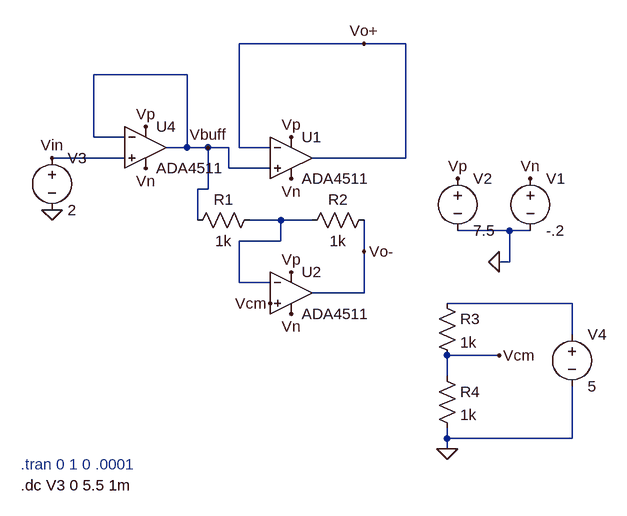
[diagram p0: schematic DiffPCBLTSpice.asc]
DiffPCBLTSpice.asc, the LTspice schematic file:
Version 4
SHEET 1 880 680
WIRE 208 -160 16 -160
WIRE 272 -160 208 -160
WIRE -64 -112 -208 -112
WIRE -208 -16 -208 -112
WIRE -160 -16 -208 -16
WIRE -64 0 -64 -112
WIRE -64 0 -96 0
WIRE -32 0 -64 0
WIRE 0 0 -32 0
WIRE 16 0 16 -160
WIRE 64 0 16 0
WIRE -160 16 -272 16
WIRE 272 16 272 -160
WIRE 272 16 128 16
WIRE 0 32 0 0
WIRE 64 32 0 32
WIRE -32 64 -32 0
WIRE -32 64 -48 64
WIRE -48 112 -48 64
WIRE 80 112 32 112
WIRE 128 112 80 112
WIRE 432 128 352 128
WIRE 464 128 432 128
WIRE 80 144 80 112
WIRE 80 144 16 144
WIRE 208 160 208 112
WIRE 432 176 432 128
WIRE 432 176 416 176
WIRE 16 208 16 144
WIRE 64 208 16 208
WIRE 208 224 208 160
WIRE 208 224 128 224
WIRE 528 240 336 240
WIRE 528 288 528 240
WIRE 416 320 336 320
WIRE 336 352 336 320
WIRE 336 448 336 432
WIRE 528 448 528 368
WIRE 528 448 336 448
WIRE 336 464 336 448
FLAG 416 176 0
FLAG 352 48 Vp
FLAG 464 48 Vn
FLAG 96 -16 Vp
FLAG -128 -32 Vp
FLAG 96 192 Vp
FLAG 96 48 Vn
FLAG -128 32 Vn
FLAG 96 256 Vn
FLAG 416 320 Vcm
FLAG 336 464 0
FLAG 64 240 Vcm
FLAG -272 96 0
FLAG -272 16 Vin
FLAG -32 0 Vbuff
FLAG 208 -160 Vo+
FLAG 208 160 Vo-
SYMBOL voltage 464 32 R0
WINDOW 123 0 0 Left 0
WINDOW 39 0 0 Left 0
SYMATTR InstName V1
SYMATTR Value -.2
SYMBOL voltage 352 32 R0
WINDOW 123 0 0 Left 0
WINDOW 39 0 0 Left 0
SYMATTR InstName V2
SYMATTR Value 7.5
SYMBOL res 48 96 R90
WINDOW 0 0 56 VBottom 2
WINDOW 3 32 56 VTop 2
SYMATTR InstName R1
SYMATTR Value 1k
SYMATTR SpiceLine tol=.01
SYMBOL res 224 96 R90
WINDOW 0 0 56 VBottom 2
WINDOW 3 32 56 VTop 2
SYMATTR InstName R2
SYMATTR Value 1k
SYMATTR SpiceLine tol=0.01
SYMBOL res 320 224 R0
SYMATTR InstName R3
SYMATTR Value 1k
SYMBOL res 320 336 R0
SYMATTR InstName R4
SYMATTR Value 1k
SYMBOL OpAmps\\ADA4511 -128 -64 R0
SYMATTR InstName U4
SYMBOL OpAmps\\ADA4511 96 -48 R0
SYMATTR InstName U1
SYMBOL OpAmps\\ADA4511 96 160 R0
SYMATTR InstName U2
SYMBOL voltage -272 0 R0
WINDOW 123 0 0 Left 0
WINDOW 39 0 0 Left 0
SYMATTR InstName V3
SYMATTR Value 2
SYMBOL voltage 528 272 R0
WINDOW 123 0 0 Left 0
WINDOW 39 0 0 Left 0
SYMATTR InstName V4
SYMATTR Value 5
TEXT -320 488 Left 2 ;.tran 0 1 0 .0001
TEXT -320 520 Left 2 !.dc V3 0 5.5 1m

The netlist it stands for:
* DiffPCBLTSpice.asc
V1 Vn 0 -.2
V2 Vp 0 7.5
R1 N001 Vbuff 1k tol=.01
R2 Vo- N001 1k tol=0.01
R3 N002 Vcm 1k
R4 Vcm 0 1k
XU4 Vin Vbuff Vp Vn Vbuff ADA4511  ; pins In+ In- V+ V- OUT
XU1 Vbuff Vo+ Vp Vn Vo+ ADA4511  ; pins In+ In- V+ V- OUT
XU2 Vcm N001 Vp Vn Vo- ADA4511  ; pins In+ In- V+ V- OUT
V3 Vin 0 2
V4 N002 0 5
* .tran 0 1 0 .0001
.dc V3 0 5.5 1m
.backanno
.end